# EAGLE design ELEC GPS Shield v1.1 (EAGLE 7.2.0)
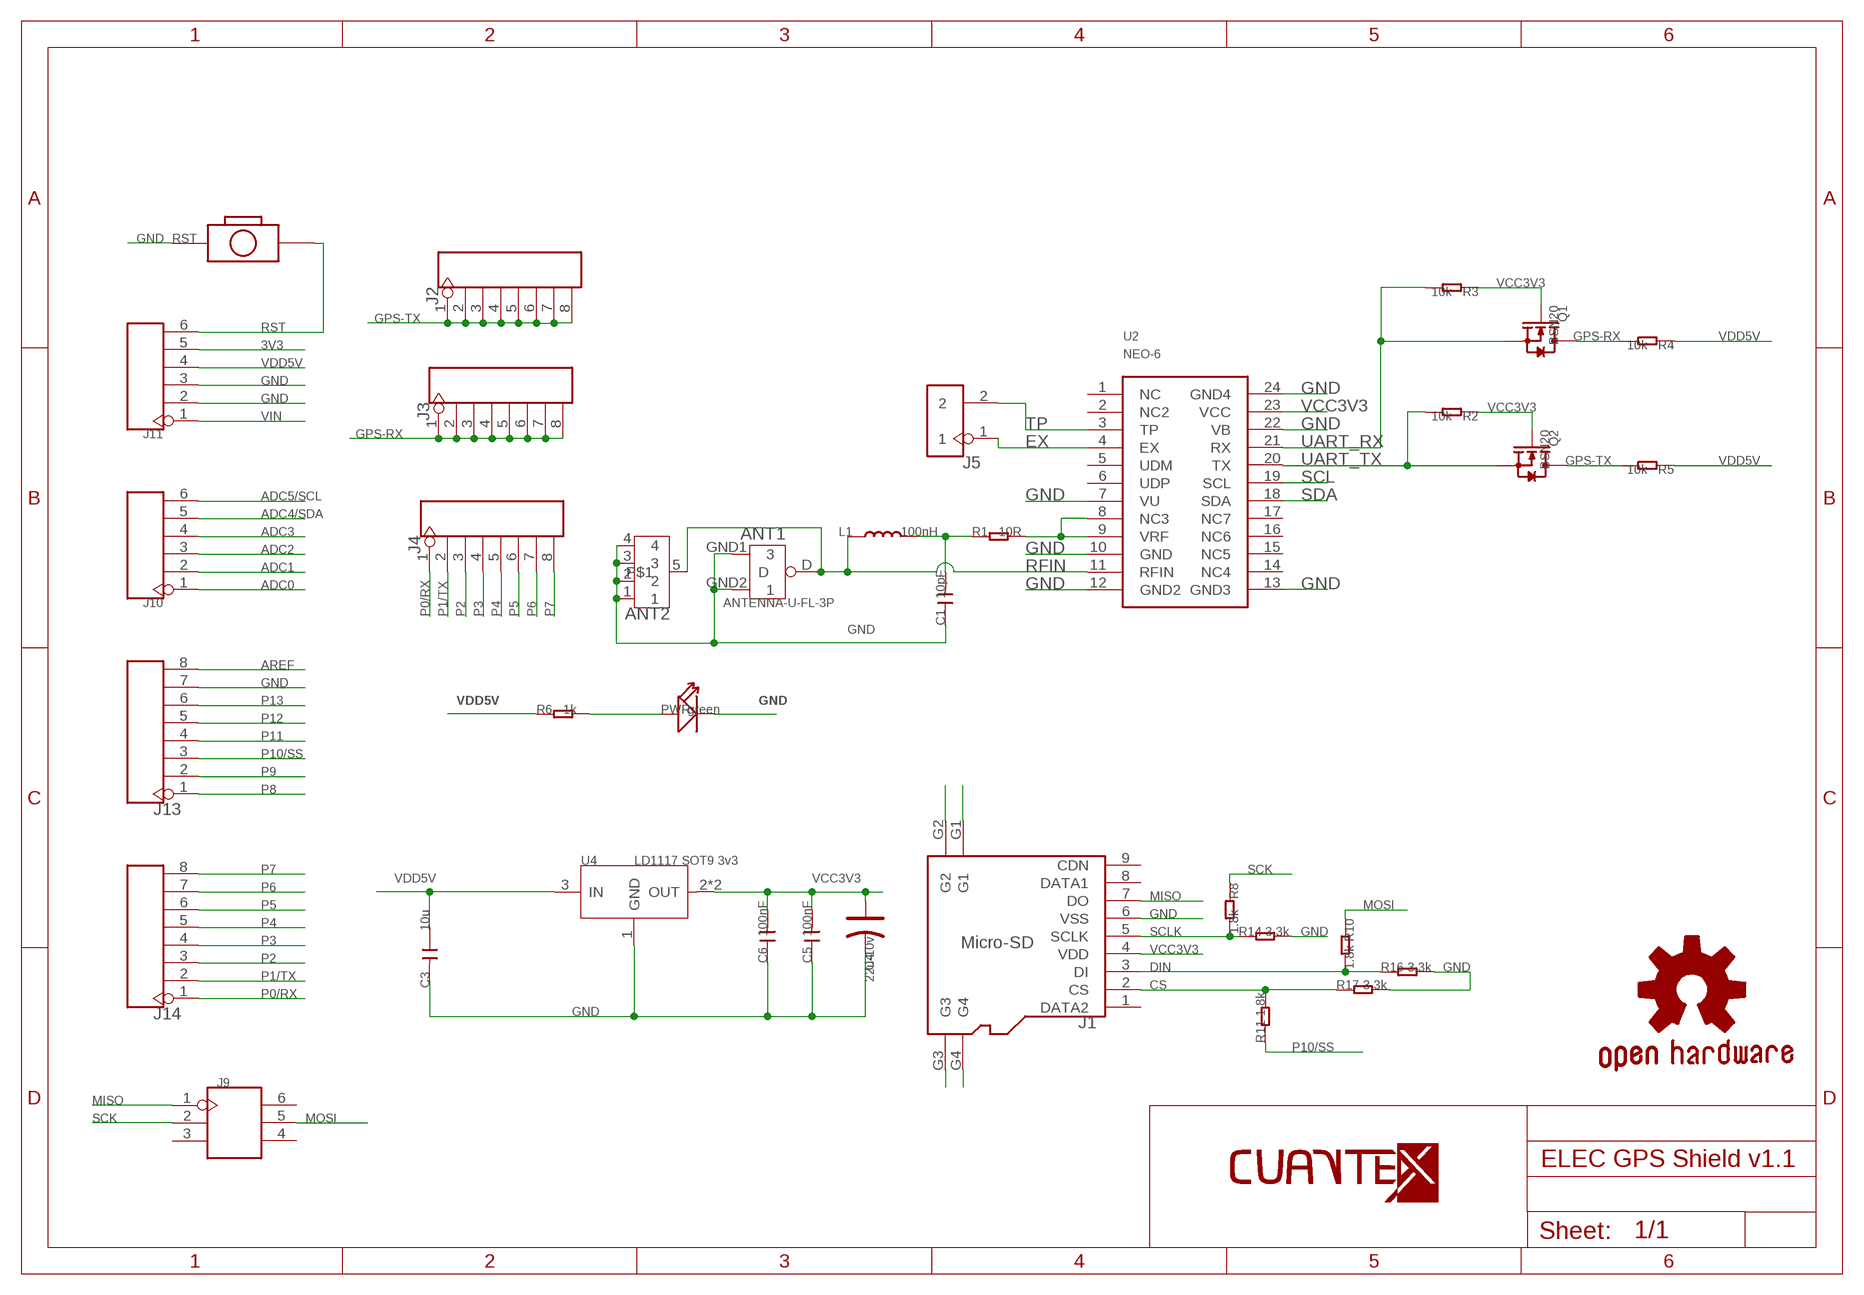
[diagram p0: schematic, sheet 1]

## Parts
ANT1  ANTENNA-U-FL-3P  [3P-U-FL]
ANT2  ANTENNA-SMA-IPX  [SMA-TO-IPX]
C1  10pF  C-0603  [C0603]
C3  10u  C-0805  [C0805]
C4  22u-10v  CAP-AVX-B  [AVX-B]
C5  100nF  C-0603  [C0603]
C6  100nF  C-0603  [C0603]
GOLD_ORB_SM1  OSHWLOGO_GOLD_ORB_SM  [OSHW2]
J1  Micro-SD  HOLDER-MICROSD-9P  [9P-SMD-W/-RING]
J2  HEADER-8P-65/35MIL  [8P-2.54-65/35MIL]
J3  HEADER-8P-65/35MIL  [8P-2.54-65/35MIL]
J4  HEADER-8P-65/35MIL  [8P-2.54-65/35MIL]
J5  HEADER-2P-65/35MIL  [2P-2.54-65/35MIL]
J9  HEADER-2X3P-65/35MIL  [2X3P-2.54-65/35MIL]
J10  HEADER-6P-60/35MIL  [6P-2.54-60/35MIL]
J11  HEADER-6P-60/35MIL  [6P-2.54-60/35MIL]
J13  HEADER-8P-65/35MIL  [8P-2.54-65/35MIL]
J14  HEADER-8P-65/35MIL  [8P-2.54-65/35MIL]
L1  100nH  L'0603'  [L0603]
PWR  green  LED'0603'  [LED-0603]
Q1  BSN20  MOSFET-N'SOT23'  [SOT23]
Q2  BSN20  MOSFET-N'SOT23'  [SOT23]
R1  10R  R-0603  [R0603]
R2  10k  R-0603  [R0603]
R3  10k  R-0603  [R0603]
R4  10k  R-0603  [R0603]
R5  10k  R-0603  [R0603]
R6  1k  R-0603  [R0603]
R8  1.8k  R-0603  [R0603]
R10  1.8k  R-0603  [R0603]
R11  1.8k  R-0603  [R0603]
R14  3.3k  R-0603  [R0603]
R16  3.3k  R-0603  [R0603]
R17  3.3k  R-0603  [R0603]
RST  BOTTON-2P-90D  [2P-7.62X3.56-90D]
U2  NEO-6  [NEO-6]
U4  LD1117 SOT9 3v3  LD1117'SOT89'  [SOT89]
U$1  LOGO-BOT-40MM  [B-40]
U$3  LOGO-TOP-20MM  [C-0]

## Nets
3V3: J11.5
ADC0: J10.1
ADC1: J10.2
ADC2: J10.3
ADC3: J10.4
ADC4/SDA: J10.5
ADC5/SCL: J10.6
AREF: J13.8
CS: J1.2(CS) R11.2 R17.1
DIN: J1.3(DI) R10.2 R16.1
EX: J5.1 U2.4(EX)
GND: ANT1.GND1 ANT1.GND2 ANT2.1 ANT2.2 ANT2.3 ANT2.4 C1.1 C3.2 C4.- C5.1 C6.1 J1.6(VSS) J11.2 J11.3 J13.7 PWR.- R14.2 R16.2 R17.2 RST.P$1 U2.7(VU) U2.10(GND) U2.12(GND2) U2.13(GND3) U2.22(VB) U2.24(GND4) U4.1(GND)
GPS-RX: J3.1 J3.2 J3.3 J3.4 J3.5 J3.6 J3.7 J3.8 Q1.3(D) R4.2
GPS-TX: J2.1 J2.2 J2.3 J2.4 J2.5 J2.6 J2.7 J2.8 Q2.3(D) R5.2
MISO: J1.7(DO) J9.1
MOSI: J9.5 R10.1
N$1: PWR.+ R6.2
N$8: R1.2 U2.8(NC3) U2.9(VRF)
N$45: J1.G4
N$46: J1.G3
N$47: J1.G1
N$48: J1.G2
N$61: C1.2 L1.2 R1.1
P0/RX: J4.1 J14.1
P1/TX: J4.2 J14.2
P2: J4.3 J14.3
P3: J4.4 J14.4
P4: J4.5 J14.5
P5: J4.6 J14.6
P6: J4.7 J14.7
P7: J4.8 J14.8
P8: J13.1
P9: J13.2
P10/SS: J13.3 R11.1
P11: J13.4
P12: J13.5
P13: J13.6
RFIN: ANT1.D ANT2.5 L1.1 U2.11(RFIN)
RST: J11.6 RST.P$2
SCK: J9.2 R8.1
SCL: U2.19(SCL)
SCLK: J1.5(SCLK) R8.2 R14.1
SDA: U2.18(SDA)
TP: J5.2 U2.3(TP)
UART_RX: Q1.2(S) R3.2 U2.21(RX)
UART_TX: Q2.2(S) R2.2 U2.20(TX)
VCC3V3: C4.+ C5.2 C6.2 J1.4(VDD) Q1.1(G) Q2.1(G) R2.1 R3.1 U2.23(VCC) U4.2(OUT) U4.4(OUT)
VDD5V: C3.1 J11.4 R4.1 R5.1 R6.1 U4.3(IN)
VIN: J11.1
Unconnected: J1.1(DATA2) J1.8(DATA1) J1.9(CDN) J9.3 J9.4 J9.6 U2.1(NC) U2.2(NC2) U2.5(UDM) U2.6(UDP) U2.14(NC4) U2.15(NC5) U2.16(NC6) U2.17(NC7)

## Library data of the parts
ANT1 = Connector:ANTENNA-U-FL-3P
ANT2 = Elecrow_test:ANTENNA-SMA-IPX
C1 C3 C5 C6 = Discrete:C*: Ceramic Capacitors
C4 = Discrete:CAP*: Electrolytic Capacitors,Tantalum Capacitors and Super Capacitors
GOLD_ORB_SM1 = OPENHW:OSHWLOGO: These are Open-Source Hardware logos.
J1 = Connector:HOLDER-MICROSD-9P
J2-J4 J13 J14 = Connector:HEADER-8P
J5 = Connector:HEADER-2P
J9 = Connector:HEADER-2X3P
J10 J11 = Connector:HEADER-6P
L1 = Discrete:L*
PWR = Discrete:LED*
Q1 Q2 = Discrete:MOSFET-N: IRLL014: http://www.vishay.com/docs/91319/sihll014.pdf
R1-R6 R8 R10 R11 R14 R16 R17 = Discrete:R*
RST = Discrete:BOTTON-2P
U2 = Elecrow_test:NEO-6
U4 = IC:LD1117: Low Drop Fixed And Adjustable Positive Voltage Regulators http://www.datasheetcatalog.org/datasheet/SGSThomsonMicroelectronics/mXuqtqv.pdf
U$1 = LOGOTIPOS:LOGO-BOT-40MM
U$3 = LOGOTIPOS:LOGO-TOP-20MM

## Net classes
0 default: width 0.152 mm, drill 0.152 mm, clearance 0.152 mm

## Board
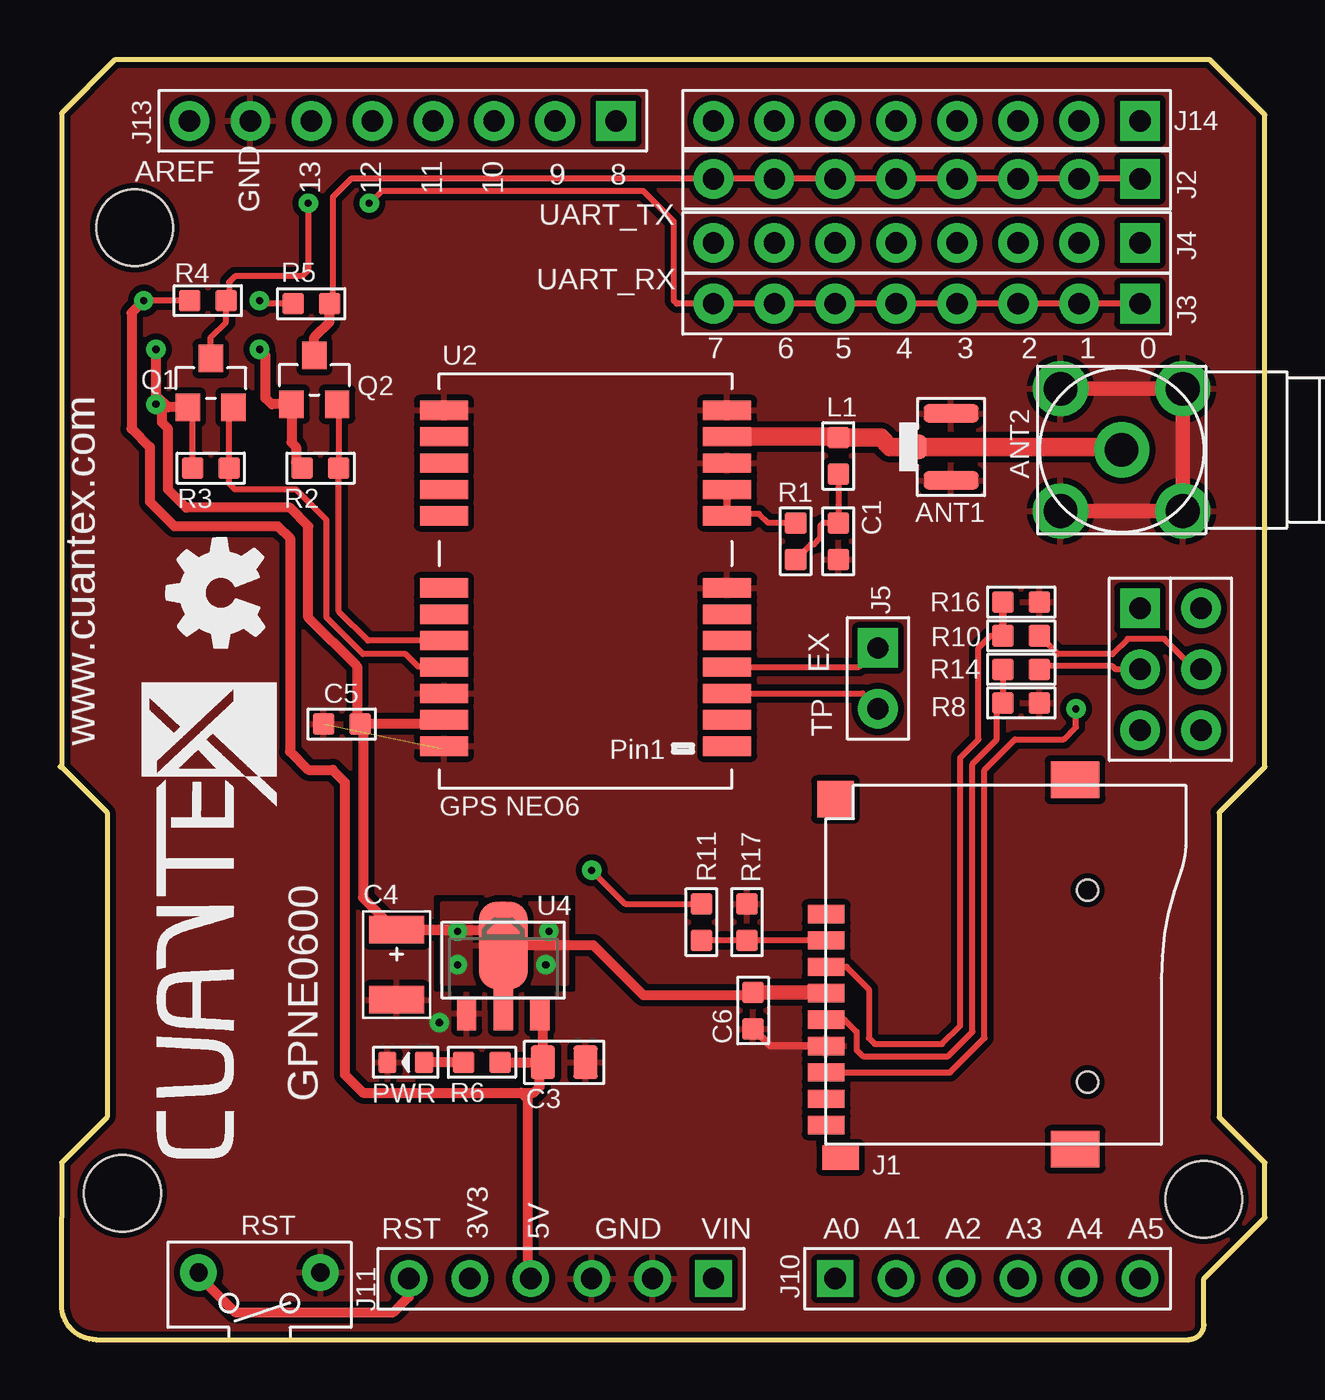
[diagram p1: board, top side]
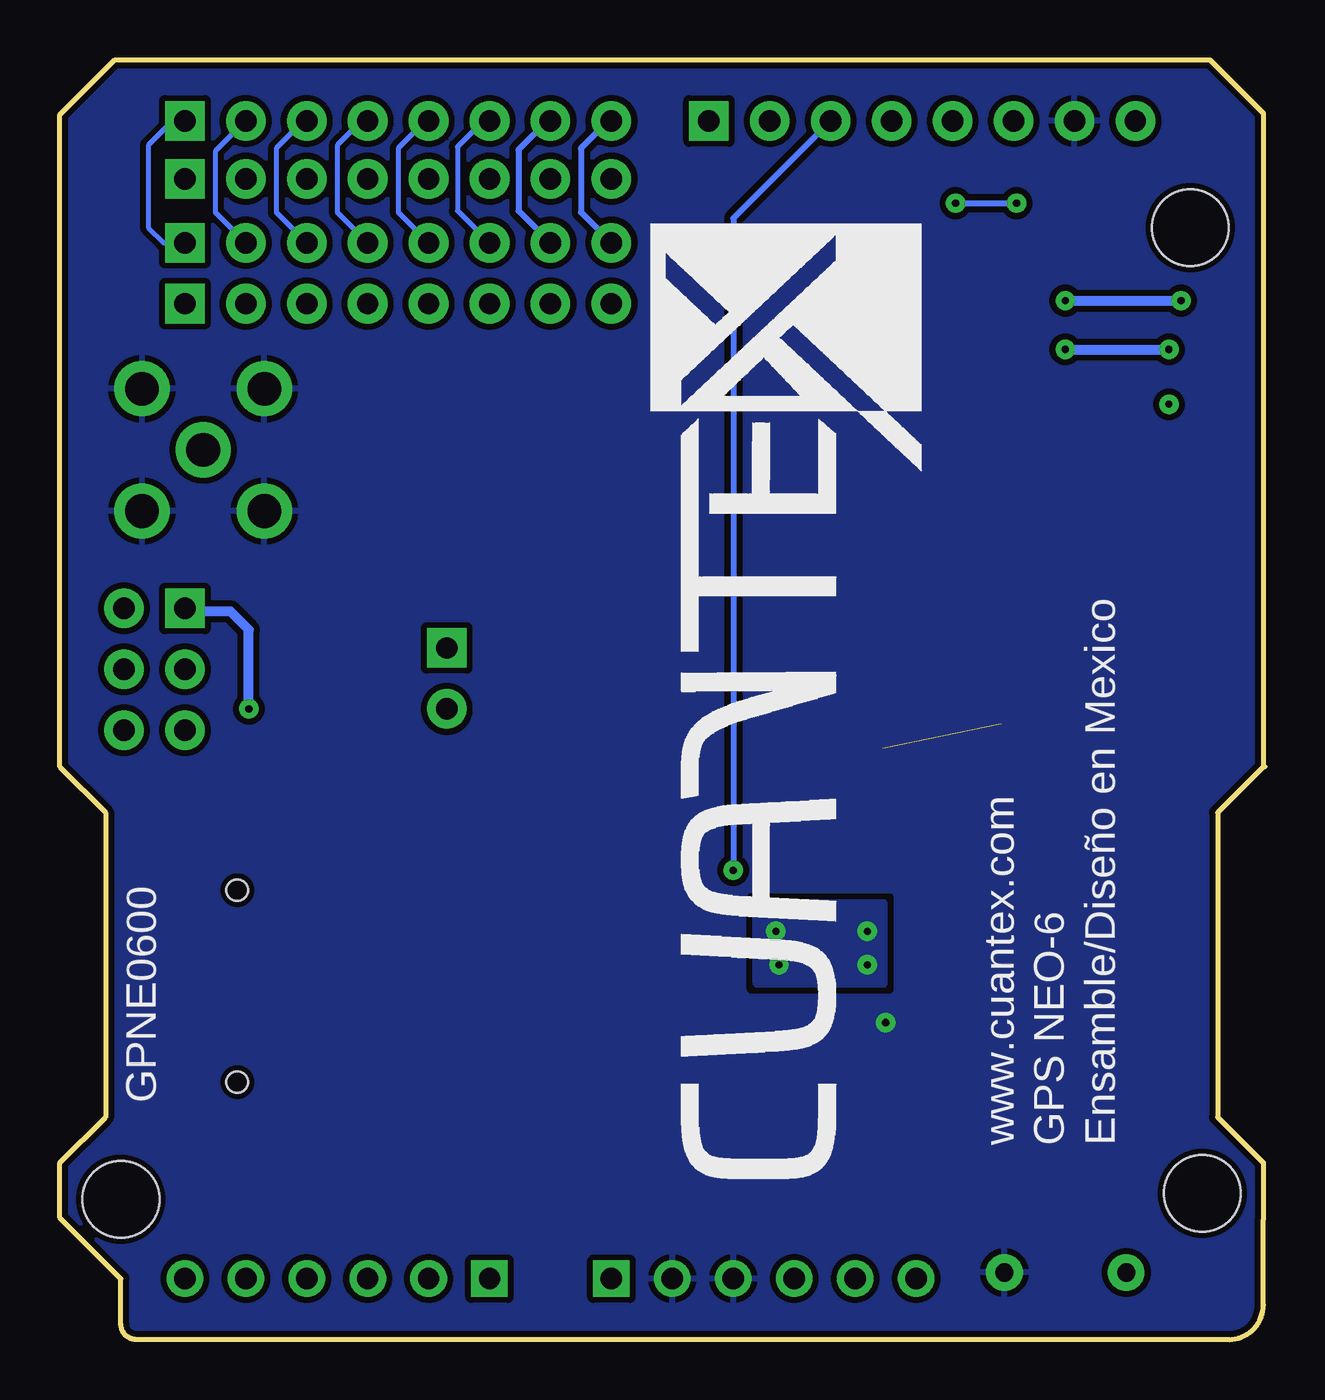
[diagram p2: board, bottom side, seen from below]

Size 50.23 x 53.34 mm. Coordinates in mm from the lower left corner, seen from the top.
Outline: 0.06,23.88 0.06,51.12 2.29,53.34 47.94,53.34 50.23,51.05 50.23,23.88 48.32,21.97 48.32,9.27 50.23,7.37 50.23,5.08 47.69,2.54 47.69,0.64 arc-90 47.05,0 1.5,0 arc-90 0.06,1.44 0.06,5.02
Outline: 0.06,5.08 0.06,7.37 1.97,9.27 1.97,21.97 0.06,23.88
Outline: 0,23.88 0.06,23.88
Copper layers (1*16): Top 0.035mm / dielectric 1.5mm / Bottom 0.035mm
Design rules "cuantex2layerdrc": minimum track width 8mil, minimum drill 0.3mm, track to track 8mil, track to pad 8mil, pad to pad 8mil, via to via 8mil, smd to smd 0mil, copper to edge 10mil, drill to drill 10mil, minimum pad ring 10mil, minimum via ring 10mil, stop-mask expansion 4mil, vias tented up to drill 0mil, thermal gap 10mil
Holes 3.2 mm at 47.69,5.84 3.11,46.36 2.6,6.1

### Footprints (pad centres in the part's own frame; a part is rotated, then mirrored left to right if it is on the bottom)
3P-U-FL = smd 1.016 x 1.016: D -1.524,0.127 | smd 2.286 x 0.762: GND1 0,1.524; GND2 0,-1.27
SMA-TO-IPX = drill 1.4 pad 2.3: 1 -2.55,2.55; 2 2.55,2.55; 3 2.55,-2.55; 4 -2.55,-2.55; 5 0,0
C0603 = smd 0.889 x 0.889: 1 -0.762,0; 2 0.762,0
C0805 = smd 1.016 x 1.397: 1 -0.889,0; 2 0.889,0
AVX-B = smd 1.143 x 2.286: + -1.46,0; - 1.46,0
9P-SMD-W/-RING = smd 1.524 x 0.762: 1 0,4.4; 2 0,3.3; 3 0,2.2; 4 0,1.1; 5 0,0; 6 0,-1.1; 7 0,-2.2; 8 0,-3.3; 9 0,-4.4 | smd 1.524 x 1.016: G1 0.6,-5.746 | smd 2.032 x 1.524: G2 10.373,-5.4; G3 10.373,10 | smd 1.524 x 1.524: G4 0.392,9.181 | hole 0.889: 10.9,-2.6; 10.9,5.4
8P-2.54-65/35MIL = drill 0.889 pad 1.651 square: 1 0,8.89 | drill 0.889 pad 1.651: 2 0,6.35; 3 0,3.81; 4 0,1.27; 5 0,-1.27; 6 0,-3.81; 7 0,-6.35; 8 0,-8.89
2P-2.54-65/35MIL = drill 0.889 pad 1.651 square: 1 0,1.27 | drill 0.889 pad 1.651: 2 0,-1.27
2X3P-2.54-65/35MIL = drill 0.889 pad 1.651 square: 1 -1.27,2.54 | drill 0.889 pad 1.651: 2 -1.27,0; 3 -1.27,-2.54; 4 1.27,-2.54; 5 1.27,0; 6 1.27,2.54
6P-2.54-60/35MIL = drill 0.889 pad 1.524 square: 1 0,6.35 | drill 0.889 pad 1.524: 2 0,3.81; 3 0,1.27; 4 0,-1.27; 5 0,-3.81; 6 0,-6.35
L0603 = smd 0.889 x 0.889: 1 -0.762,0; 2 0.762,0
LED-0603 = smd 0.762 x 0.889: + -0.762,0; - 0.762,0
SOT23 = smd 1.016 x 1.143: 1 -0.95,-1.016; 2 0.95,-1.016; 3 0,1.016
R0603 = smd 0.889 x 0.889: 1 -0.762,0; 2 0.762,0
2P-7.62X3.56-90D = drill 0.762 pad 1.524: P$1 0,2.54; P$2 0,-2.54
NEO-6 = smd 2 x 0.8: 1 5.396,-6.507; 2 5.396,-5.407; 3 5.396,-4.307; 4 5.396,-3.207; 5 5.396,-2.107; 6 5.396,-1.007; 7 5.396,0.093; 8 5.396,3.093; 9 5.396,4.193; 10 5.396,5.293; 11 5.396,6.393; 12 5.396,7.493; 13 -6.404,7.493; 14 -6.404,6.393; 15 -6.404,5.293; 16 -6.404,4.193; 17 -6.404,3.093; 18 -6.404,0.093; 19 -6.404,-1.007; 20 -6.404,-2.107; 21 -6.404,-3.207; 22 -6.404,-4.307; 23 -6.404,-5.407; 24 -6.404,-6.507
SOT89 = smd 0.8 x 1.4: 1 -1.524,-1.905; 3 1.524,-1.905 | smd 0.8 x 1.9: 2 0,-1.651 | smd 2.032 x 3.65: 4 0,0.94

### Placement (x,y rotation side)
ANT1  37.15,37.08 0 top
ANT2  44.26,37.08 90 top
C1  32.45,33.27 90 top
C3  21.02,11.56 0 top
C4  14.03,15.62 270 top
C5  11.75,25.65 0 top
C6  28.89,13.72 90 top
GOLD_ORB_SM1  10.99,27.31 90 top
J1  31.94,13.34 0 top
J2  36.13,48.39 270 top
J3  36.13,43.18 270 top
J4  36.13,45.72 270 top
J5  34.1,27.56 0 top
J9  46.29,27.94 0 top
J10  38.67,2.54 90 top
J11  20.89,2.54 270 top
J13  14.29,50.8 270 top
J14  36.13,50.8 270 top
L1  32.45,36.83 270 top
PWR  14.41,11.56 180 top
Q1  6.29,39.88 0 top
Q2  10.6,40.01 0 top
R1  30.67,33.27 90 top
R2  10.86,36.32 0 top
R3  6.29,36.32 0 top
R4  6.16,43.31 0 top
R5  10.48,43.18 0 top
R6  17.59,11.56 180 top
R8  40.07,27.94 180 top
R10  40.07,29.34 180 top
R11  26.73,17.4 270 top
R14  40.07,26.54 0 top
R16  40.07,30.73 0 top
R17  28.64,17.4 90 top
RST  8.32,2.79 270 top
U2  22.42,31.24 0 top
U4  18.48,15.49 0 top
U$1  14.21,46.56 270 top
U$3  9.08,7.49 90 top

### Tracks (layer width: path | path; a pad name or v marks a point on that pad's centre or on a via)
CS
  Top 0.254: R11.2 R17.1 J1.2
  Top 0.61: J1.2
DIN
  Top 0.254: R10.2 38.8,29.34 38.29,28.83 38.29,25.02 37.53,24.26 37.53,13.08 36.77,12.32 33.97,12.32 33.72,12.57 33.72,14.61 32.79,15.54 J1.3
  Top 0.305: R16.1 R10.2
EX
  Top 0.254: U2.4 33.31,28.04 J5.1
GND  (via drill 0.3)  (1 unrouted)
  Top 0.305: U2.7 27.9,31.24 | U2.10 27.9,36.45 | J1.6 29.61,12.24 C6.1 | U2.22 | U2.24 15.91,24.64
  Top 0.61: ANT2.1 ANT2.4 ANT2.3 ANT2.2
  other vias: 15.81,13.21
  pour Top (isolate 0.254, rank 6): 0.06,0 50.23,0 50.23,53.34 0.06,53.34 0.06,0.13
  pour Bottom (isolate 0.254, rank 6): 50.23,0 50.23,53.47 0.06,53.47 0.06,0
GPS-RX  (via drill 0.3 pad 0.25)
  Top 0.254: J3.1 J3.2 J3.3 J3.4 J3.5 J3.6 J3.7 J3.8 25.72,43.18 25.59,43.31 25.59,46.61 24.32,47.88 13.4,47.88 v12.89,47.37 | Q1.3 6.29,41.78 6.92,42.42 R4.2 7.05,43.43 7.05,44.07 7.3,44.32 10.1,44.32 10.35,44.58 v10.35,47.37
  Bottom 0.254: v12.89,47.37 v10.35,47.37
GPS-TX
  Top 0.254: J2.1 J2.2 J2.3 J2.4 J2.5 J2.6 J2.7 J2.8 12.13,48.39 11.37,47.63 11.37,43.31
  Top 0.406: Q2.3 10.6,41.78 11.24,42.42 R5.2 11.37,43.31
MISO  (via drill 0.3)
  Top 0.254: J1.7 37.11,11.14 38.54,12.57 38.54,23.75 39.81,25.02 41.85,25.02 42.35,25.53 v42.35,26.29
  Bottom 0.406: v42.35,26.29 42.35,29.59 43.12,30.35 44.89,30.35 J9.1
MOSI
  Top 0.254: J9.5 47.31,27.94 46.04,29.21 44.51,29.21 43.88,28.58 41.59,28.58 R10.1
N$1
  Top 0.406: R6.2 PWR.+
N$8
  Top 0.254: R1.2 29.53,34.04 29.15,34.42 27.89,34.42
  Top 0.305: 27.89,34.42 U2.8 U2.9
N$61
  Top 0.254: L1.2 C1.2 31.81,34.04 31.69,33.91 31.69,33.4 31.43,33.15 31.31,33.15 R1.1
  Top 0.305: 30.8,32.51 R1.1 30.8,32.64
P0/RX
  Bottom 0.203: J14.1 45.53,50.8 46.55,49.78 46.55,46.36 45.91,45.72 J4.1
P1/TX
  Bottom 0.203: J14.2 43.75,49.53 43.75,46.99 J4.2
P2
  Bottom 0.203: J14.3 40.07,50.8 41.21,49.66 41.21,46.99 J4.3
P3
  Bottom 0.203: J14.4 37.66,50.8 38.67,49.78 38.67,46.99 J4.4
P4
  Bottom 0.203: J14.5 34.99,50.8 36.13,49.66 36.13,46.99 J4.5
P5
  Bottom 0.203: J14.6 32.58,50.8 33.65,49.72 33.65,47.05 J4.6
P6
  Bottom 0.203: J14.7 29.91,50.8
  Bottom 0.254: 29.91,50.8 31.12,49.59 31.12,47.05 J4.7
P7
  Bottom 0.203: J14.8 27.37,50.8
  Bottom 0.254: 27.37,50.8 28.51,49.66 28.51,46.99 J4.8
P10/SS  (via drill 0.3)
  Top 0.254: v22.16,19.56 23.56,18.16 R11.1
  Bottom 0.254: J13.3 22.16,46.74 v22.16,19.56
RFIN
  Top 0.61: U2.11 27.85,37.59
  Top 0.762: U2.11 32.45,37.64 | L1.1 34.23,37.59 34.61,37.21 ANT1.D 44.13,37.21 ANT2.5
  Top 0.813: 32.45,37.64 L1.1
RST
  Top 0.406: RST.P$2 5.78,2.67 7.3,1.14 13.91,1.14 14.54,1.78 J11.6
SCK
  Top 0.254: J9.2 44.01,27.94 43.88,28.07 40.96,28.07 R8.1
SCLK
  Top 0.254: R8.2 R14.1 39.05,26.29 39.05,25.02 38.04,24 38.04,12.83 37.02,11.81 33.46,11.81 33.21,12.07 33.21,12.83 32.7,13.34 J1.5
TP
  Top 0.254: U2.3 33.45,26.94 J5.2
UART_RX
  Top 0.254: 7.05,38.67 R3.2 7.05,35.69 7.3,35.43 9.84,35.43 11.11,34.16 11.11,30.1 12.64,28.58 14.41,28.58 14.95,28.04 U2.21
  Top 0.406: 7.05,38.67 Q1.2
UART_TX
  Top 0.254: U2.20 12.84,29.14 11.62,30.35 R2.2 11.62,38.92
  Top 0.406: 11.62,38.92 Q2.2
VCC3V3  (via drill 0.3, 0.3 pad 0.25)
  Top 0.254: R3.1 5.52,38.67 | U2.23 15.83,25.65
  Top 0.305: v16.57,17.02 16.51,17.08 | C5.2 12.64,25.53 | 13.97,17.08 C4.+
  Top 0.406: C4.+ 17.83,17.08 | 5.52,38.67 Q1.1 4.51,38.86 | U4.4 22.24,16.43 24.32,14.35 28.77,14.35 | R2.1 9.84,36.58 9.84,37.21 9.65,37.4 Q2.1 8.83,38.99 8.57,39.24 8.57,41.02 v8.32,41.28 | C4.+ 18.41,17.08 | 15.83,25.65 C5.2 12.38,25.78 12.38,28.07 10.35,30.1 10.35,33.91 9.59,34.67 5.27,34.67 4.51,35.43 4.51,37.97 4.25,38.23 4.25,38.74 v4,38.99 4.13,38.86 4.51,38.86 | 16.51,17.08 C4.+ | 12.64,25.53 12.64,18.42 13.97,17.08 | v4,41.28 4,39.37 4.51,38.86
  Top 0.61: J1.4 31.9,14.48 C6.2 28.77,14.35
  Top 0.813: U4.2 U4.4
  Bottom 0.406: v8.32,41.28 v4,41.28
  other vias: 16.57,15.62 20.26,15.62 20.38,17.02
  pour Top: 15.94,14.86 16.07,14.86 21.15,14.86 21.15,18.16 15.94,18.16
  pour Bottom: 15.94,14.86 21.15,14.86 21.15,17.53 21.15,18.16 15.94,18.16
VDD5V  (via drill 0.3 pad 0.25)
  Top 0.254: R5.1 8.45,43.18 v8.32,43.31 | 5.27,43.18 5.14,43.31 v3.49,43.31
  Top 0.406: 5.27,43.18 R4.1 | R6.1 C3.1 | C3.1 20.13,13.46 U4.3 | v3.49,43.31 2.98,42.8 2.98,37.97 3.75,37.21 3.75,34.93 4.76,33.91 9.08,33.91 9.59,33.4 9.59,24.51 10.35,23.75 11.37,23.75 11.87,23.24 11.87,11.05 12.64,10.29 19.24,10.29 | 19.24,10.29 19.49,10.03 19.49,2.67 J11.4 | 19.24,10.29 19.75,10.29 20,10.54 20,11.43 C3.1
  Bottom 0.406: v8.32,43.31 v3.49,43.31

### Text on the board
tPlace: AREF | 9 | 8 | GND | 13 | 12 | 11 | 10 | UART_TX | UART_RX | 7 | 6 | 5 | 4 | 3 | 2 | 1 | 0 | EX | Pin1 | TP | www.cuantex.com | GPS NEO6 | GPNE0600 | RST | 3V3 | 5V | GND | VIN | A0 | A1 | A2 | A3 | A4 | A5
bPlace: GPNE0600 | Ensamble/Diseño en Mexico | GPS NEO-6 | www.cuantex.com